# Altium schematic sheet Sheet1.SchDoc
size A4; SheetNumber: 1; SheetTotal: 1
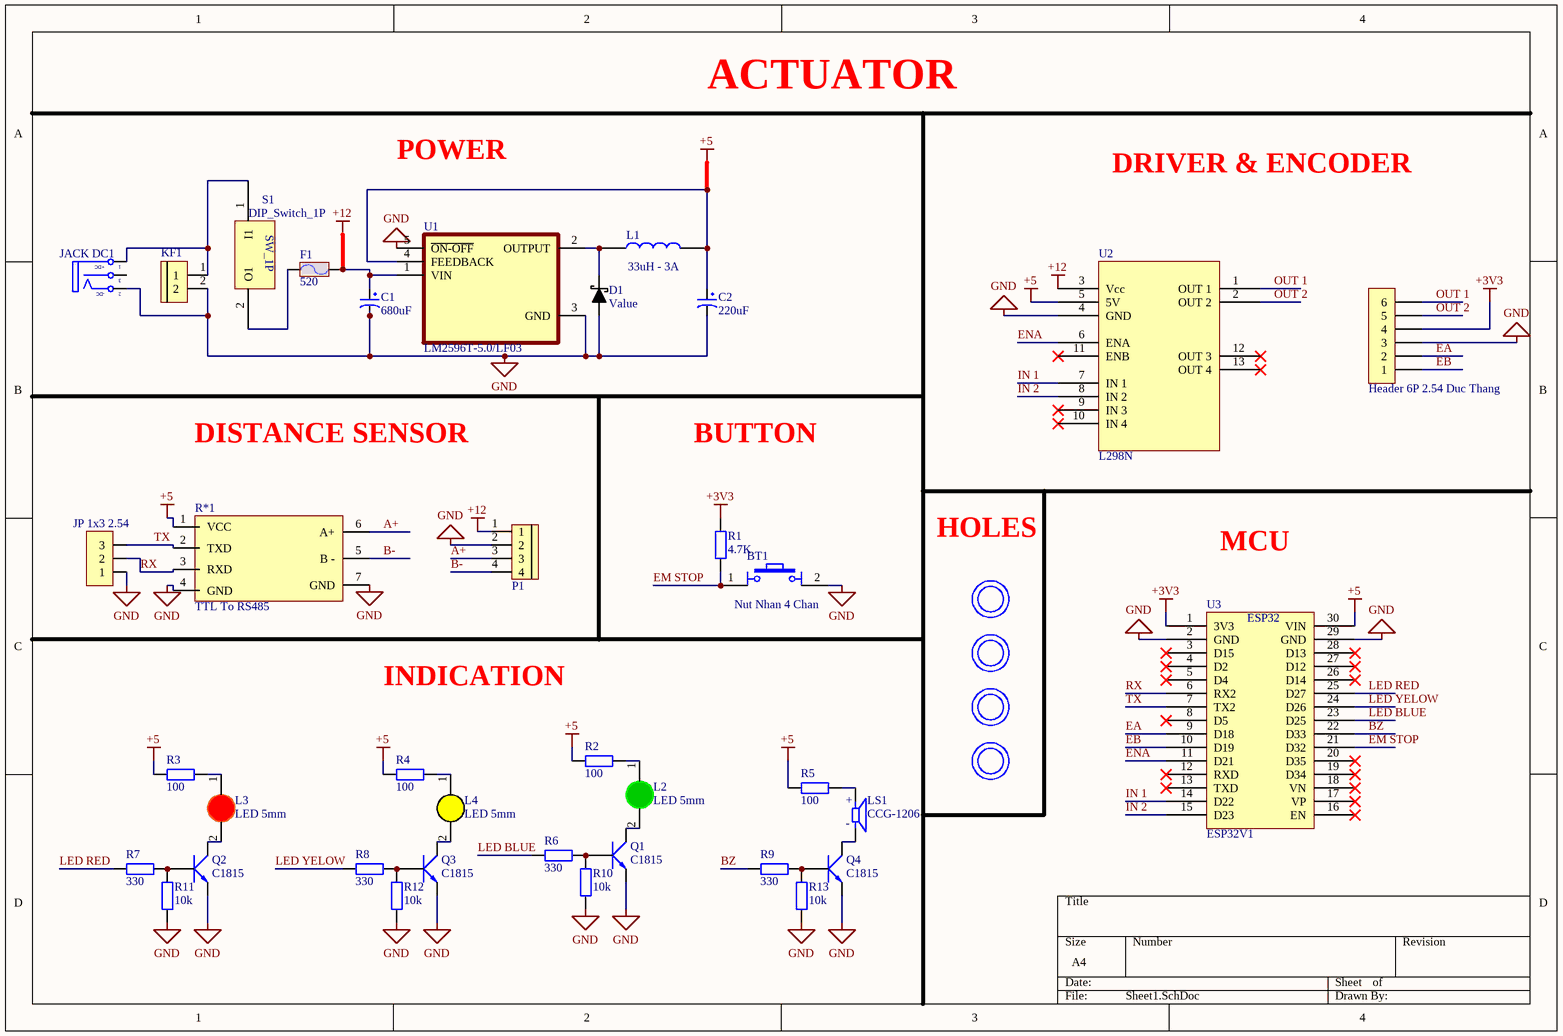
[diagram p0: Sheet1.SchDoc]

## Parts
1  Hole  [Hole]  (value not drawn)
2  Hole  [Hole]  (value not drawn)
3  Hole  [Hole]  (value not drawn)
4  Hole  [Hole]  (value not drawn)
BT1  Nut Nhan 4 Chan  [Nut Nhan 4 Chan Cam 6x6]
C1  680uF  [tu hoa 13mm]
C2  220uF  [tu hoa 6.5mm]
D1  Value  [DIODE_SMALL]
F1  520  [De Cau Chi 520 630]
H1  Header 6P 2.54 Duc Thang  [XH2.54M-6]
JACK_DC1  JACK DC 5.5  [JACK DC 5.5]  (value not drawn)
JP1  JP 1x3 2.54  [JP 1x3 DT]
KF1  CON 2 KF301  [Con 2 KF301 5.08]  (value not drawn)
L1  33uH - 3A  [CUON CAM 100uH3A]
L2  LED 5mm  [LED-5MM-Green]
L3  LED 5mm  [LED-5MM-RED]
L4  LED 5mm  [LED-5MM-Yellow]
LS1  CCG-1206  [CUI_CCG-1206]
P1  CON 4 EDG5.08  [CON 4 4EDG5.08 - THANG]  (value not drawn)
Q1  C1815  [TO92]
Q2  C1815  [TO92]
Q3  C1815  [TO92]
Q4  C1815  [TO92]
R1  4.7K  [tro vach 1/4w]
R2  100  [tro vach 1/4w]
R3  100  [tro vach 1/4w]
R4  100  [tro vach 1/4w]
R5  100  [tro vach 1/4w]
R6  330  [tro vach 1/4w]
R7  330  [tro vach 1/4w]
R8  330  [tro vach 1/4w]
R9  330  [tro vach 1/4w]
R10  10k  [tro vach 1/4w]
R11  10k  [tro vach 1/4w]
R12  10k  [tro vach 1/4w]
R13  10k  [tro vach 1/4w]
R*1  TTL To RS485  [TTL TO RS485_Module]
S1  DIP_Switch_1P  [DIP_Switch_1P]
U1  LM2596T-5.0/LF03  [TO170P1016X470X2092-5]
U2  L298N  [L298N]
U3  ESP32V1  [ESP32V1]

## Nets
+3V3: H1.4 R1.1 U3.1(3V3)
+5: C2.1 L1.2 R2.2 R3.2 R4.2 R5.2 R*1.1(VCC) U1.4(FEEDBACK) U2.5(5V) U3.30(VIN)
+12: C1.1 F1.2 P1.1 U1.1(VIN) U2.3(Vcc)
GND: BT1.2 C1.2 C2.2 D1.1(A) H1.3 JACK_DC1.2(TN) JP1.1 KF1.2 P1.2 Q1.1(E) Q2.1(E) Q3.1(E) Q4.1(E) R10.1 R11.1 R12.1 R13.1 R*1.4(GND) R*1.7(GND) U1.3(GND) U1.5(~{ON-OFF}) U2.4(GND) U3.2(GND) U3.29(GND)
A+: P1.3 R*1.6(A+)
B-: P1.4 R*1.5(B_-)
BZ: R9.2 U3.22(D33)
EA: H1.2 U3.9(D18)
EB: H1.1 U3.10(D19)
EM STOP: BT1.1 R1.2 U3.21(D32)
ENA: U2.6(ENA) U3.11(D21)
IN 1: U2.7(IN_1) U3.14(D22)
IN 2: U2.8(IN_2) U3.15(D23)
LED BLUE: R6.2 U3.23(D25)
LED RED: R7.2 U3.25(D27)
LED YELOW: R8.2 U3.24(D26)
OUT 1: H1.6 U2.1(OUT_1)
OUT 2: H1.5 U2.2(OUT_2)
RX: JP1.2 R*1.3(RXD) U3.6(RX2)
TX: JP1.3 R*1.2(TXD) U3.7(TX2)
NetD1_2: D1.2(K) L1.1 U1.2(OUTPUT)
NetF1_1: F1.1 S1.2(O1)
NetJACK_DC1_1: JACK_DC1.1(T) KF1.1 S1.1(I1)
NetL2_1: L2.1(A) R2.1
NetL2_2: L2.2(K) Q1.2(C)
NetL3_1: L3.1(A) R3.1
NetL3_2: L3.2(K) Q2.2(C)
NetL4_1: L4.1(A) R4.1
NetL4_2: L4.2(K) Q3.2(C)
NetLS1_M: LS1.M Q4.2(C)
NetLS1_P: LS1.P R5.1
NetQ1_3: Q1.3(B) R6.1 R10.2
NetQ2_3: Q2.3(B) R7.1 R11.2
NetQ3_3: Q3.3(B) R8.1 R12.2
NetQ4_3: Q4.3(B) R9.1 R13.2

Not connected (* = marked no-connect by the designer): JACK_DC1 3(S); U2 9(IN_3)* 10(IN_4)* 11(ENB)* 12(OUT_3)* 13(OUT_4)*; U3 3(D15)* 4(D2)* 5(D4)* 8(D5)* 12(RXD)* 13(TXD)* 16(EN)* 17(VP)* 18(VN)* 19(D34)* 20(D35)* 26(D14)* 27(D12)* 28(D13)*

## Notes on the sheet
- POWER
- DRIVER & ENCODER
- DISTANCE SENSOR
- BUTTON
- HOLES
- MCU
- INDICATION
- Labels drawn without touching a wire or pin: ACTUATOR
- (in symbol CCG-1206) +; -
- (in symbol DIP_Switch_1P) SW_1P
- (in symbol ESP32V1) ESP32
- (in symbol JACK DC 5.5) +DC; -DC

## Library data of the parts
1-4 = Hole: cắm
BT1 = Nut Nhan 4 Chan Cam 6x6: Nut Nhan 4 Chan 6x6mm; Ten: Nút Nhấn 4 Chân 6x6x5MM DIP; Ma_Hang: MH004584
C1 = Tu Hoa 680uF 25V 13x17: Cắm; Don_Vi: Con; So_Chan: 2; Ten_Linh_Kien: Tụ Hóa 680uF 25V; Ma_Hang: MH005082; Chung_Loai: Cắm; Kieu_Chan: *
C2 = Tu Hoa 220uF 16V 7x11: Cắm; Don_Vi: Con; Ten_Linh_Kien: Tụ Hóa 220uF 16V 7x11MM; So_Chan: 2; Ma_Hang: MH008416; Chung_Loai: Cắm; Kieu_Chan: *
D1 = Diode schottky
F1 = De Cau Chi 520 630: 5x20mm; Ma_Hang: MH001473; Ten: Đế Cầu Chì 5x20MM 6x30MM SMD01
H1 = Header 6P 2.54 Duc Thang: Cắm; Ten_Linh_Kien: Header 6P XH2.54-6P Đực Thẳng; Don_Vi: Con; Ma_Hang: MH001972; Chung_Loai: Cắm
JACK_DC1 = JACK DC 5.5: Value: Jac DC
JP1 = JP 1x3 2.54 Duc Thang: Cắm; Ten_Linh_Kien: Jump Đơn Đực 2.54MM 1x40P Thẳng 11MM; Don_Vi: Con; Ma_Hang: MH000903; Ghi_Chu: *; Kieu_Chan: *; Chung_Loai: Cắm
KF1 = CON 2 KF301: Cắm; Ma_Hang: MH000987; Ten_Linh_Kien: CON 2 KF301-2P 5.08MM Xanh Dương; Chung_Loai: Cắm; Ghi_Chu: *; Kieu_Chan: *; Don_Vi: Con
L1 = CUON CAM 470uH DIP: Cắm; Don_Vi: Con; Ma_Hang: MH002232; Ten_Linh_Kien: Cuộn Cảm 470uH 3A 8x10MM; Ghi_Chu: *; Kieu_Chan: *; Chung_Loai: Cắm
L2 = LED 5mm Xanh La: Cắm; Don_Vi: Con; Ma_Hang: MH008969; Ten_Linh_Kien: LED 5MM Phủ Xanh (1000c); Ghi_Chu: *; Kieu_Chan: *; Chung_Loai: Cắm
L3 = LED 5mm Do: Cắm; Don_Vi: Con; Ma_Hang: MH008967; Ten_Linh_Kien: Led 5MM Phủ Đỏ (1000c); Ghi_Chu: *; Kieu_Chan: *; Chung_Loai: Cắm
L4 = LED 5mm Vang: Cắm; Don_Vi: Con; Ma_Hang: MH008968; Ten_Linh_Kien: Led 5MM Phủ Vàng (1000c); Ghi_Chu: *; Kieu_Chan: *; Chung_Loai: Cắm
LS1 = CCG-1206: 12 mm, 5 V, 85 dB, Through Hole, Sealed, Magnetic Audio Transducer Buzzer; MF: Same Sky; SnapEDA_Link: https://www.snapeda.com/parts/CCG-1206/Same+Sky/view-part/?ref=snap; Package: None; Value: *; MP: CCG-1206; Check_prices: https://www.snapeda.com/parts/CCG-1206/Same+Sky/view-part/?ref=eda
P1 = CON 4 EDG5.08: Cắm; Ten_Linh_Kien: CON 4 2EDG5.08-4P 5.08MM ( Xanh Cong); Ma_Hang: MH000979; Don_Vi: Con; Ghi_Chu: *; Kieu_Chan: *; Chung_Loai: Cắm
Q1-Q4 = C1815: NPN transistor; Value: C9014
R1-R13 = Tro Vach 1/4W 5% 100R: Cắm; Don_Vi: Con; So_Chan: 2; Ten_Linh_Kien: Trở Vạch 1/4w 5% 100R; Ma_Hang: MH007353; Chung_Loai: Cắm; Kieu_Chan: *
S1 = DIP_Switch_1P: cắm
U1 = LM2596T-5.0/LF03: SIMPLE SWITCHERÂ® 4.5V to 40V, 3A Low Component Count Step-Down Regulator; MF: Texas Instruments; SnapEDA_Link: https://www.snapeda.com/parts/LM2596T-5.0/LF03/Texas+Instruments/view-part/?ref=snap; Package: TO-220-5 Texas Instruments; Value: *; MP: LM2596T-5.0/LF03; Check_prices: https://www.snapeda.com/parts/LM2596T-5.0/LF03/Texas+Instruments/view-part/?ref=eda
U2 = L298N: Cắm
U3 = ESP32V1: cắm